# Altium project gowin_vga_ble.PrjPCB
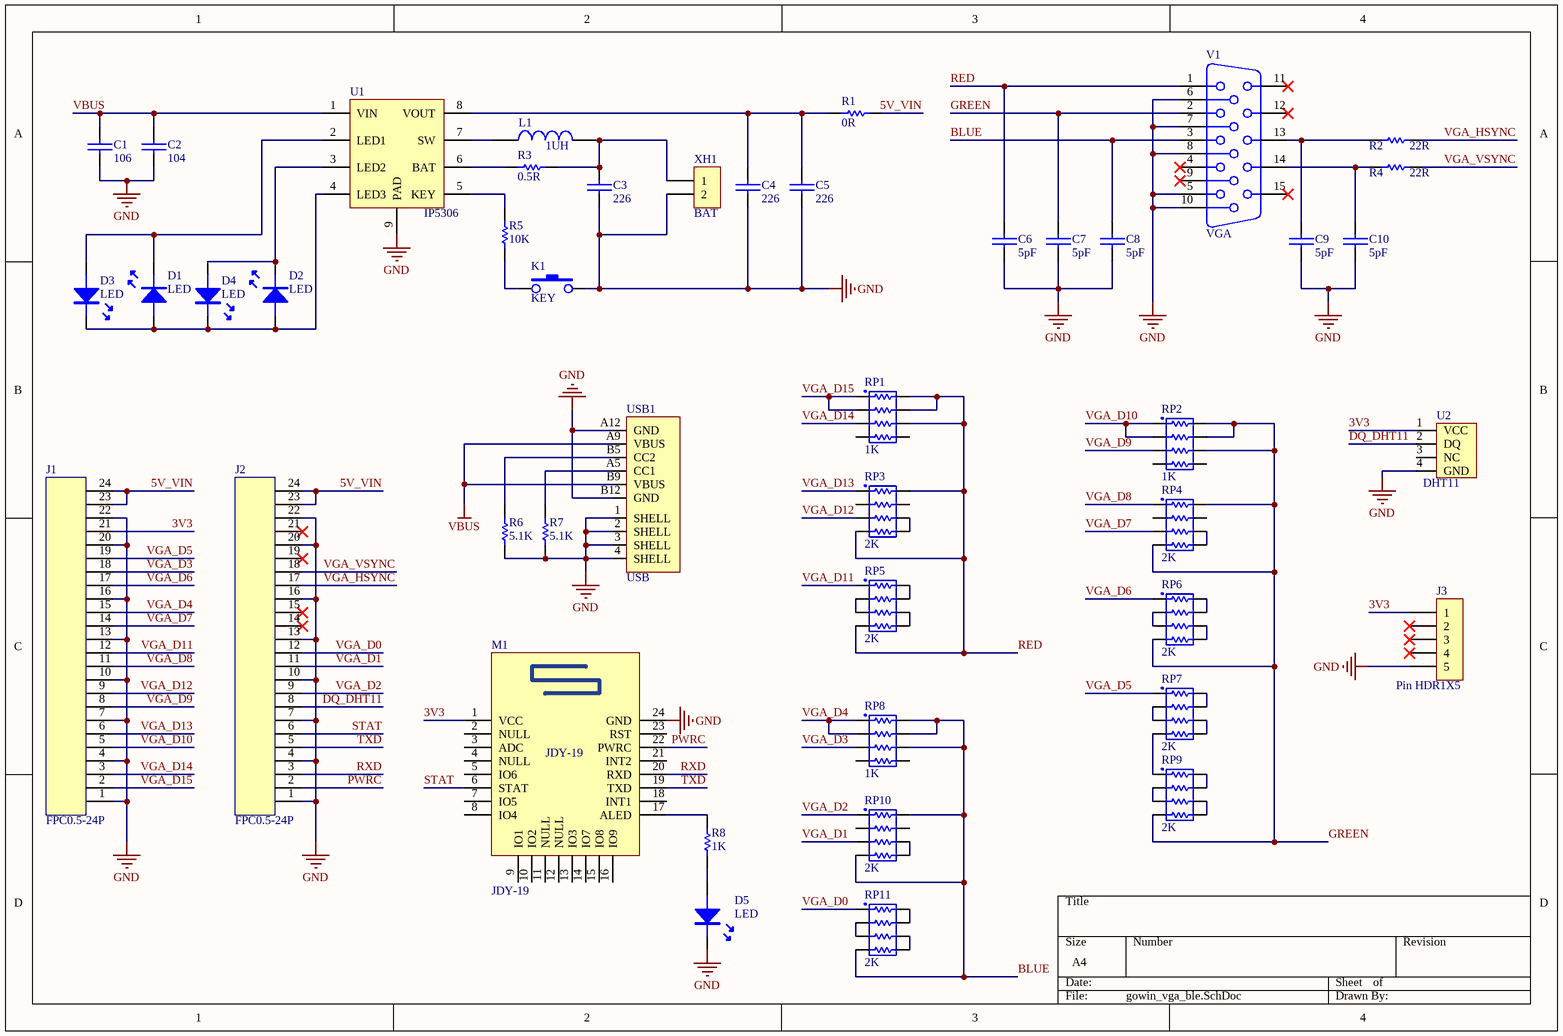
[diagram p0: gowin_vga_ble.SchDoc]
1 sheet, 45 parts. Net scope: global (net labels, ports and power ports of the same name join across sheets).
Board file: gowin_vga_ble.PcbDoc

## Sheet gowin_vga_ble.SchDoc
size A4

### Parts
C1  106  [0603C]
C2  104  [0603C]
C3  226  [0603C]
C4  226  [0603C]
C5  226  [0603C]
C6  5pF  [0603C]
C7  5pF  [0603C]
C8  5pF  [0603C]
C9  5pF  [0603C]
C10  5pF  [0603C]
D1  LED  [LED-0603G]
D2  LED  [LED-0603G]
D3  LED  [LED-0603G]
D4  LED  [LED-0603G]
D5  LED  [LED-0603B]
J1  FPC0.5-24P  [FPC0.5-24P]
J2  FPC0.5-24P  [FPC0.5-24P]
J3  Pin HDR1X5  [Pin HDR1X5/2.54mm-S]
K1  KEY  [SMD-3X6X4.3]
L1  1UH  [0630L]
M1  JDY-19  [JDY-19]
R1  0R  [0603R]
R2  22R  [0603R]
R3  0.5R  [0603R]
R4  22R  [0603R]
R5  10K  [0603R]
R6  5.1K  [0603R]
R7  5.1K  [0603R]
R8  1K  [0603R]
RP1  1K  [贴片排阻]
RP2  1K  [贴片排阻]
RP3  2K  [贴片排阻]
RP4  2K  [贴片排阻]
RP5  2K  [贴片排阻]
RP6  2K  [贴片排阻]
RP7  2K  [贴片排阻]
RP8  1K  [贴片排阻]
RP9  2K  [贴片排阻]
RP10  2K  [贴片排阻]
RP11  2K  [贴片排阻]
U1  IP5306  [SOP8-PAD]
U2  DHT11  [DHT11]
USB1  USB  [USB-C-6PIN]
V1  VGA  [VGA15/F/90]
XH1  BAT  [XH2/2.54mm/90]

### Nets
GND: C1.1 C2.1 C3.1 C4.1 C5.1 C6.1 C7.1 C8.1 C9.1 C10.1 D5.K J1.1 J1.4 J1.7 J1.10 J1.13 J1.16 J1.20 J1.22 J2.1 J2.4 J2.7 J2.10 J2.13 J2.16 J2.20 J2.22 J3.5 K1.3 M1.24(GND) R6.2 R7.2 U1.9(PAD) U2.4(GND) USB1.1(SHELL) USB1.2(SHELL) USB1.3(SHELL) USB1.4(SHELL) USB1.A12(GND) USB1.B12(GND) V1.5 V1.6 V1.7 V1.8 V1.10 XH1.2
VBUS: C1.2 C2.2 U1.1(VIN) USB1.A9(VBUS) USB1.B9(VBUS)
3V3: J1.21 J3.1 M1.1(VCC) U2.1(VCC)
5V_VIN: J1.23 J1.24 J2.23 J2.24 R1.2
BLUE: C8.2 RP8.6 RP8.7 RP8.8 RP10.4 RP10.8 RP11.4 V1.3
DQ_DHT11: J2.8 U2.2(DQ)
GREEN: C7.2 RP2.6 RP2.7 RP2.8 RP4.4 RP4.8 RP6.4 RP9.4 V1.2
PWRC: J2.2 M1.22(PWRC)
RED: C6.2 RP1.6 RP1.7 RP1.8 RP3.4 RP3.8 RP5.4 V1.1
RXD: J2.3 M1.20(RXD)
STAT: J2.6 M1.6(STAT)
TXD: J2.5 M1.19(TXD)
VGA_D0: J2.12 RP11.1
VGA_D1: J2.11 RP10.3
VGA_D2: J2.9 RP10.1
VGA_D3: J1.18 RP8.3
VGA_D4: J1.15 RP8.1 RP8.2
VGA_D5: J1.19 RP7.1
VGA_D6: J1.17 RP6.1
VGA_D7: J1.14 RP4.3
VGA_D8: J1.11 RP4.1
VGA_D9: J1.8 RP2.3
VGA_D10: J1.5 RP2.1 RP2.2
VGA_D11: J1.12 RP5.1
VGA_D12: J1.9 RP3.3
VGA_D13: J1.6 RP3.1
VGA_D14: J1.3 RP1.3
VGA_D15: J1.2 RP1.1 RP1.2
VGA_HSYNC: J2.17 R2.2
VGA_VSYNC: J2.18 R4.2
NetC3_2: C3.2 L1.2 R3.2 XH1.1
NetC4_2: C4.2 C5.2 R1.1 U1.8(VOUT)
NetC9_2: C9.2 R2.1 V1.13
NetC10_2: C10.2 R4.1 V1.14
NetD1_A: D1.A D2.A D3.K D4.K U1.4(LED3)
NetD1_K: D1.K D3.A U1.2(LED1)
NetD2_K: D2.K D4.A U1.3(LED2)
NetD5_A: D5.A R8.2
NetK1_1: K1.1 R5.1
NetL1_1: L1.1 U1.7(SW)
NetM1_17: M1.17(ALED) R8.1
NetR3_1: R3.1 U1.6(BAT)
NetR5_2: R5.2 U1.5(KEY)
NetR6_1: R6.1 USB1.B5(CC2)
NetR7_1: R7.1 USB1.A5(CC1)
NetRP3_5: RP3.5 RP3.6
NetRP4_5: RP4.5 RP4.6
NetRP5_2: RP5.2 RP5.3
NetRP5_5: RP5.5 RP5.6
NetRP5_7: RP5.7 RP5.8
NetRP6_2: RP6.2 RP6.3
NetRP6_5: RP6.5 RP6.6
NetRP6_7: RP6.7 RP6.8
NetRP7_2: RP7.2 RP7.3
NetRP7_4: RP7.4 RP9.1
NetRP7_5: RP7.5 RP7.6
NetRP7_7: RP7.7 RP7.8
NetRP9_2: RP9.2 RP9.3
NetRP9_5: RP9.5 RP9.6
NetRP9_7: RP9.7 RP9.8
NetRP10_5: RP10.5 RP10.6
NetRP11_2: RP11.2 RP11.3
NetRP11_5: RP11.5 RP11.6
NetRP11_7: RP11.7 RP11.8

Not connected (* = marked no-connect by the designer): J2 14* 15* 19* 21*; J3 2* 3* 4*; M1 2(NULL) 3(ADC) 4(NULL) 5(IO6) 7(IO5) 8(IO4) 9(IO1) 10(IO2) 11(NULL) 12(NULL) 13(IO3) 14(IO7) 15(IO8) 16(IO9) 18(INT1) 21(INT2) 23(RST); RP1 4(1) 5(2); RP2 4(1) 5(2); RP3 2(1) 7(2); RP4 2(1) 7(2); RP8 4(1) 5(2); RP10 2(1) 7(2); U2 3(NC); V1 4* 9* 11* 12* 15*

### Library data of the parts
C1-C10 = CAP: 无极性电容
J1 J2 = FPC0.5-24P: 贴片
L1 = INDUCTOR
R1-R8 = RES
RP1-RP11 = SMT_RES_PACK8
U2 = DHT11: 数字温湿度传感器
USB1 = USB-C-6PIN
XH1 = XH2